# Altium project Inverter_LCEE.PrjPcb (part 2 of 2)
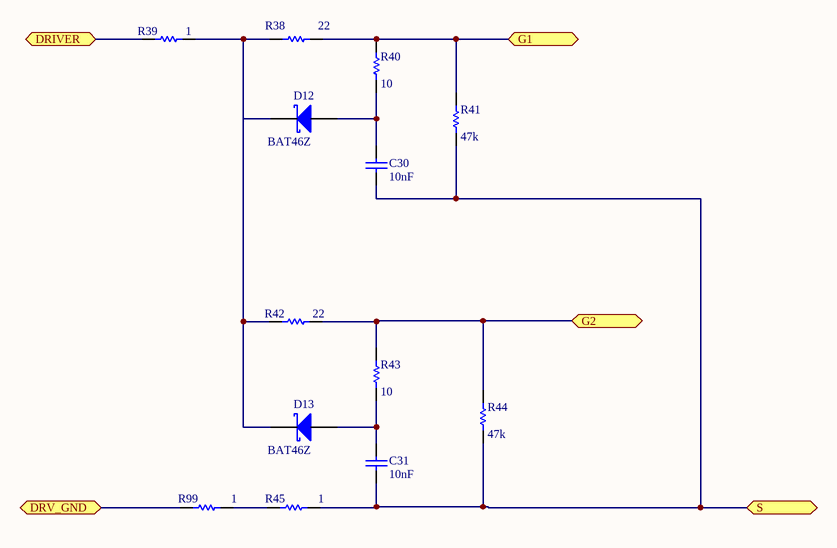
[diagram p9: GateCircuit.SchDoc]

## Nets that join several sheets
0: Main (12 pins), Phase_T1 (C25.2.1 U6_Phase_T1.4), Phase_T1/Supply_Iso (13 pins), Phase_T2 (C25.1.1 U6_Phase_T2.4), Phase_T2/Supply_Iso (13 pins), Phase_T3 (C17_Phase_T3.1 U6_Phase_T3.4), Phase_T3/Supply_Iso (13 pins), Phase_T4 (C17_Phase_T4.1 U6_Phase_T4.4), Phase_T4/Supply_Iso (13 pins), LogicCircuits (46 pins), Auxiliary (C1.1 C2.1 Q1.2 Q2.2), DT1 (11 pins), DT2 (11 pins), DT3 (11 pins), DT4 (11 pins), MainPowerSupply (14 pins), Phase_B1 (C17_Phase_B1.1 U6_Phase_B1.4), Phase_B1/Supply_Iso (13 pins), Phase_B2 (C17_Phase_B2.1 U6_Phase_B2.4), Phase_B2/Supply_Iso (13 pins), Phase_B3 (C17_Phase_B3.1 U6_Phase_B3.4), Phase_B3/Supply_Iso (13 pins), Phase_B4 (C17_Phase_B4.1 U6_Phase_B4.4), Phase_B4/Supply_Iso (13 pins)
5V_ref: Phase_T1/Supply_Iso (6 pins), Phase_T2/Supply_Iso (6 pins), Phase_T3/Supply_Iso (6 pins), Phase_T4/Supply_Iso (6 pins), Phase_B1/Supply_Iso (6 pins), Phase_B2/Supply_Iso (6 pins), Phase_B3/Supply_Iso (6 pins), Phase_B4/Supply_Iso (6 pins)
+5V: Main (Faults?.1 INV_CONTROL?.1 INV_CONTROL?.2), Phase_T1 (C25.2.2 U6_Phase_T1.1), Phase_T2 (C25.1.2 U6_Phase_T2.1), Phase_T3 (C17_Phase_T3.2 U6_Phase_T3.1), Phase_T4 (C17_Phase_T4.2 U6_Phase_T4.1), LogicCircuits (16 pins), DT1 (7 pins), DT2 (7 pins), DT3 (7 pins), DT4 (7 pins), MainPowerSupply (C42.1 D32.1 U6.2), Phase_B1 (C17_Phase_B1.2 U6_Phase_B1.1), Phase_B2 (C17_Phase_B2.2 U6_Phase_B2.1), Phase_B3 (C17_Phase_B3.2 U6_Phase_B3.1), Phase_B4 (C17_Phase_B4.2 U6_Phase_B4.1)
+5V_iso: Phase_T1 (14 pins), Phase_T1/Supply_Iso (C32.1.1 Reg1.1.2), Phase_T2 (14 pins), Phase_T2/Supply_Iso (C32.2.1 Reg1.2.2), Phase_T3 (14 pins), Phase_T3/Supply_Iso (C22_Phase_T3_Supply_Iso.1 U8_Phase_T3_Supply_Iso.2), Phase_T4 (14 pins), Phase_T4/Supply_Iso (C22_Phase_T4_Supply_Iso.1 U8_Phase_T4_Supply_Iso.2), Phase_B1 (14 pins), Phase_B1/Supply_Iso (C22_Phase_B1_Supply_Iso.1 U8_Phase_B1_Supply_Iso.2), Phase_B2 (14 pins), Phase_B2/Supply_Iso (C22_Phase_B2_Supply_Iso.1 U8_Phase_B2_Supply_Iso.2), Phase_B3 (14 pins), Phase_B3/Supply_Iso (C22_Phase_B3_Supply_Iso.1 U8_Phase_B3_Supply_Iso.2), Phase_B4 (14 pins), Phase_B4/Supply_Iso (C22_Phase_B4_Supply_Iso.1 U8_Phase_B4_Supply_Iso.2)
+9V: Phase_T1/Supply_Iso (Cin1.1.1 Cin2.1.1 Transformer1.1.2 U9.1.12), Phase_T2/Supply_Iso (Cin1.2.1 Cin2.2.1 Transformer1.2.2 U9.2.12), Phase_T3/Supply_Iso (Cin1_Phase_T3_Supply_Iso.1 Cin2_Phase_T3_Supply_Iso.1 T1_Phase_T3_Supply_Iso.2 U7_Phase_T3_Supply_Iso.12), Phase_T4/Supply_Iso (Cin1_Phase_T4_Supply_Iso.1 Cin2_Phase_T4_Supply_Iso.1 T1_Phase_T4_Supply_Iso.2 U7_Phase_T4_Supply_Iso.12), Auxiliary (6 pins), MainPowerSupply (7 pins), Phase_B1/Supply_Iso (Cin1_Phase_B1_Supply_Iso.1 Cin2_Phase_B1_Supply_Iso.1 T1_Phase_B1_Supply_Iso.2 U7_Phase_B1_Supply_Iso.12), Phase_B2/Supply_Iso (Cin1_Phase_B2_Supply_Iso.1 Cin2_Phase_B2_Supply_Iso.1 T1_Phase_B2_Supply_Iso.2 U7_Phase_B2_Supply_Iso.12), Phase_B3/Supply_Iso (Cin1_Phase_B3_Supply_Iso.1 Cin2_Phase_B3_Supply_Iso.1 T1_Phase_B3_Supply_Iso.2 U7_Phase_B3_Supply_Iso.12), Phase_B4/Supply_Iso (Cin1_Phase_B4_Supply_Iso.1 Cin2_Phase_B4_Supply_Iso.1 T1_Phase_B4_Supply_Iso.2 U7_Phase_B4_Supply_Iso.12)
+12V_iso: Phase_T1 (6 pins), Phase_T1/Supply_Iso (6 pins), Phase_T2 (6 pins), Phase_T2/Supply_Iso (6 pins), Phase_T3 (6 pins), Phase_T3/Supply_Iso (6 pins), Phase_T4 (6 pins), Phase_T4/Supply_Iso (6 pins), Phase_B1 (6 pins), Phase_B1/Supply_Iso (6 pins), Phase_B2 (6 pins), Phase_B2/Supply_Iso (6 pins), Phase_B3 (6 pins), Phase_B3/Supply_Iso (6 pins), Phase_B4 (6 pins), Phase_B4/Supply_Iso (6 pins)
GND_iso: Phase_T1 (29 pins), Phase_T1/Supply_Iso (6 pins), Phase_T2 (29 pins), Phase_T2/Supply_Iso (6 pins), Phase_T3 (29 pins), Phase_T3/Supply_Iso (6 pins), Phase_T4 (29 pins), Phase_T4/Supply_Iso (6 pins), Phase_B1 (29 pins), Phase_B1/Supply_Iso (6 pins), Phase_B2 (29 pins), Phase_B2/Supply_Iso (6 pins), Phase_B3 (29 pins), Phase_B3/Supply_Iso (6 pins), Phase_B4 (29 pins), Phase_B4/Supply_Iso (6 pins)
B_D1: MainPower (5 pins), GateCircuit_B1 (5 pins), Phase_B1 (C4_Phase_B1.1 R5_Phase_B1.2 R6_Phase_B1.2)
B_D2: MainPower (15 pins), GateCircuit_B2 (5 pins), Phase_B2 (C4_Phase_B2.1 R5_Phase_B2.2 R6_Phase_B2.2), GateCircuit_B1 (5 pins)
B_D3: MainPower (5 pins), GateCircuit_B3 (5 pins), Phase_B3 (C4_Phase_B3.1 R5_Phase_B3.2 R6_Phase_B3.2)
B_D4: MainPower (Pin_N1.1 Q2L4.2), Phase_B4 (C4_Phase_B4.1 R5_Phase_B4.2 R6_Phase_B4.2)
B_S3: MainPower (Pin_C-.1 Q1L3.3 Q2L3.3), GateCircuit_B3 (5 pins)
B_S4: MainPower (Q2L4.3), GateCircuit_B4 (5 pins)
en-ph1: LogicCircuits (D21.2 Q7.2 U10.8), DT1 (U3_DT1.2 U3_DT1.13), DT2 (U3_DT2.2 U3_DT2.13)
en-ph3: LogicCircuits (5 pins), DT3 (U3_DT3.2 U3_DT3.13), DT4 (U3_DT4.2 U3_DT4.13)
NetCin3_1: Main (SUPPLY?.3), MainPowerSupply (Cin3.1 Cinx1.1 Rt1.1 U1.1)
NetFaults?_2: Main (Faults?.2), LogicCircuits (U12.12)
NetFaults?_3: Main (Faults?.3), LogicCircuits (U12.2)
NetFaults?_4: Main (Faults?.4), LogicCircuits (U12.4)
NetFaults?_5: Main (Faults?.5), LogicCircuits (U12.6)
NetINV_CONTROL?_3: Main (INV_CONTROL?.3), LogicCircuits (U12.8 U12.10)
NetINV_CONTROL?_4: Main (INV_CONTROL?.4), LogicCircuits (R39.2 R54.2)
NetINV_CONTROL?_5: Main (INV_CONTROL?.5), LogicCircuits (R55.2 R74.2)
NetINV_CONTROL?_6: Main (INV_CONTROL?.6), LogicCircuits (R38.2 R53.2)
NetINV_CONTROL?_7: Main (INV_CONTROL?.7), LogicCircuits (R36.2 R52.2)
NetPWM_AB?_1: Main (PWM_AB?.1), LogicCircuits (R56.2 R75.2)
NetPWM_AB?_3: Main (PWM_AB?.3), LogicCircuits (R57.2 R76.2)
NetPWM_AB?_5: Main (PWM_AB?.5), LogicCircuits (R59.2 R78.2)
NetPWM_AB?_7: Main (PWM_AB?.7), LogicCircuits (R58.2 R77.2)
NetPWM_CN?_1: Main (PWM_CN?.1), LogicCircuits (R60.2 R79.2)
NetPWM_CN?_3: Main (PWM_CN?.3), LogicCircuits (R61.2 R80.2)
NetPWM_CN?_5: Main (PWM_CN?.5), LogicCircuits (R63.2 R82.2)
NetPWM_CN?_7: Main (PWM_CN?.7), LogicCircuits (R62.2 R81.2)
NetR2_1: LogicCircuits (R12.2 U11.6), Auxiliary (R2.1)
NetR4_1: LogicCircuits (R18.2 U11.11), Auxiliary (R4.1)
ok-ph1: LogicCircuits (U13.11), DT1 (C6_DT1.1 D6_DT1.1 D7_DT1.1 R11_DT1.1)
ok-ph2: LogicCircuits (U13.15), DT2 (C6_DT2.1 D6_DT2.1 D7_DT2.1 R11_DT2.1)
ok-ph3: LogicCircuits (U13.3), DT3 (C6_DT3.1 D6_DT3.1 D7_DT3.1 R11_DT3.1)
ok-ph4: LogicCircuits (U13.6), DT4 (C6_DT4.1 D6_DT4.1 D7_DT4.1 R11_DT4.1)
phB: LogicCircuits (R20.2 U14.3), DT1 (D5_DT1.1 R8_DT1.1 U3_DT1.12 U4_DT1.2)
phB: LogicCircuits (R21.2 U14.8), DT2 (D5_DT2.1 R8_DT2.1 U3_DT2.12 U4_DT2.2)
phB: LogicCircuits (R23.2 U15.3), DT3 (D5_DT3.1 R8_DT3.1 U3_DT3.12 U4_DT3.2)
phB: LogicCircuits (R25.2 U15.8), DT4 (D5_DT4.1 R8_DT4.1 U3_DT4.12 U4_DT4.2)
phT: LogicCircuits (R22.2 U14.11), DT2 (D8_DT2.1 R15_DT2.1 U3_DT2.1 U4_DT2.11)
phT: LogicCircuits (R19.2 U14.6), DT1 (D8_DT1.1 R15_DT1.1 U3_DT1.1 U4_DT1.11)
phT: LogicCircuits (R26.2 U15.11), DT4 (D8_DT4.1 R15_DT4.1 U3_DT4.1 U4_DT4.11)
phT: LogicCircuits (R24.2 U15.6), DT3 (D8_DT3.1 R15_DT3.1 U3_DT3.1 U4_DT3.11)
T_D1: MainPower (10 pins), Phase_T1 (C11.2.1 R22.2.2 R23.2.2), Phase_T2 (C11.1.1 R22.1.2 R23.1.2)
T_D3: MainPower (Pin_C+.1 Q2H4#1.2), Phase_T3 (C4_Phase_T3.1 R5_Phase_T3.2 R6_Phase_T3.2)
T_D4: MainPower (Pin_N+.1 Q1H4.2 Q2H4#2.2), Phase_T4 (C4_Phase_T4.1 R5_Phase_T4.2 R6_Phase_T4.2)
T_S4: MainPower (Pin_Nh.1 Q1H4.3 Q2H4#2.3), GateCircuit_B4 (5 pins)